# EAGLE design Busboard v4 (EAGLE 7.3.0)
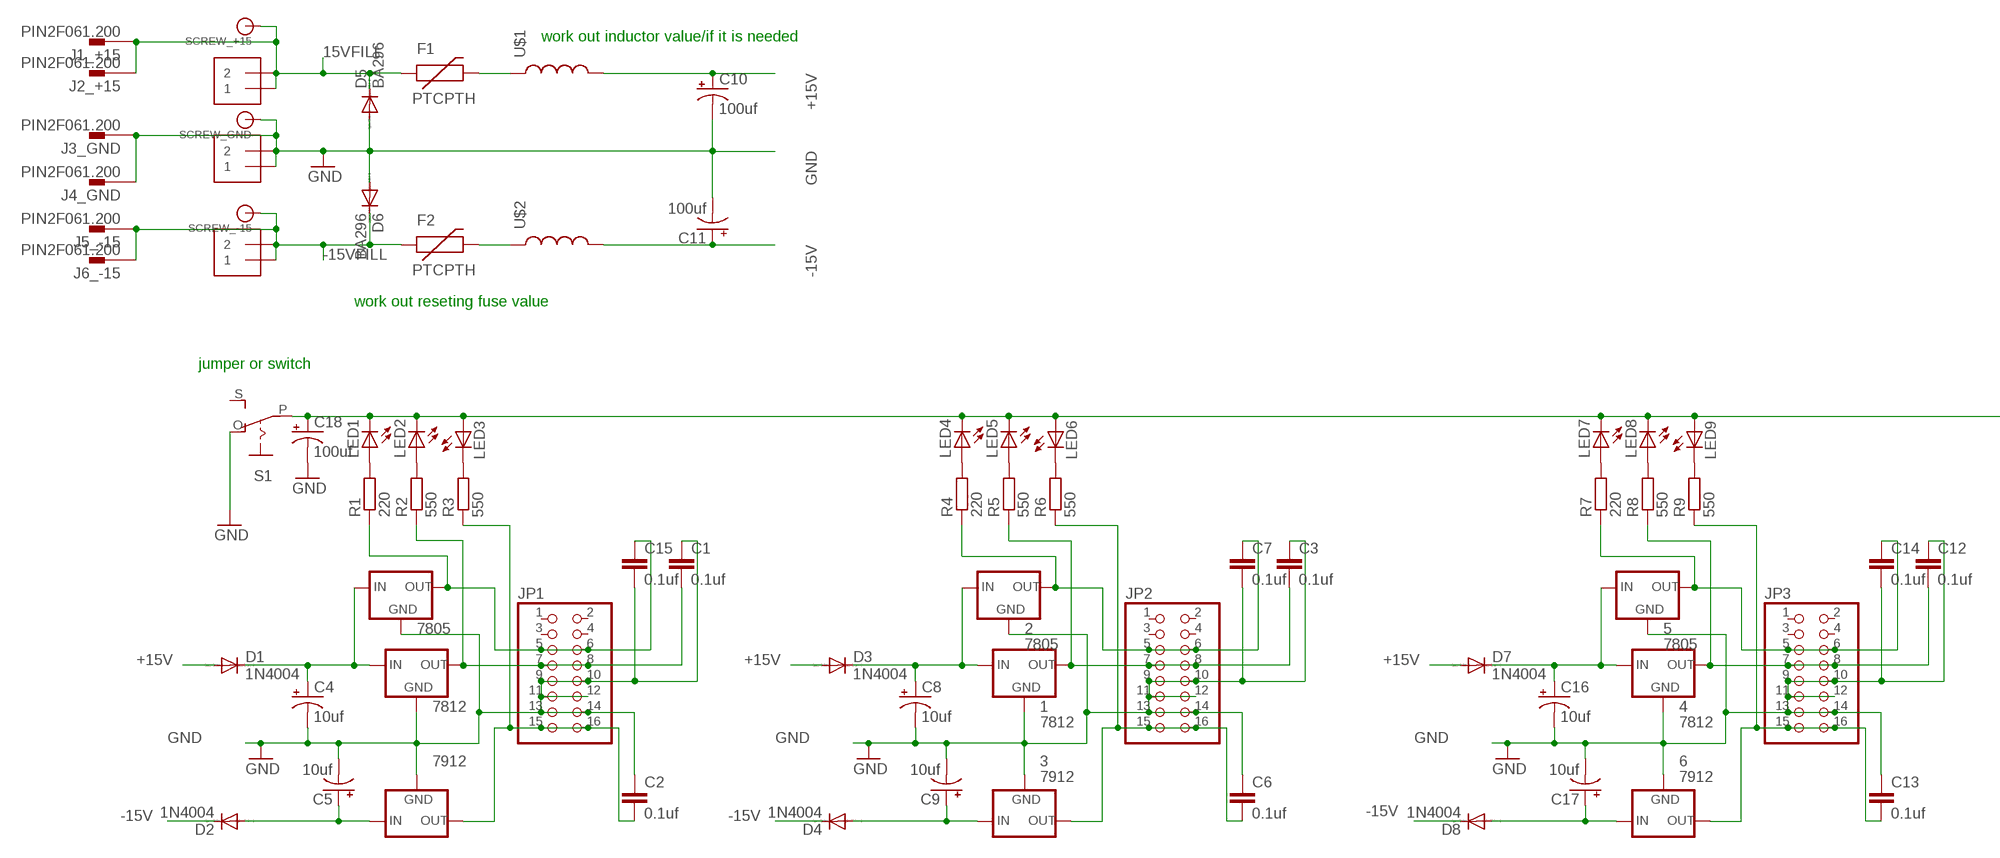
[diagram p0: schematic, sheet 1, part 1 of 2]
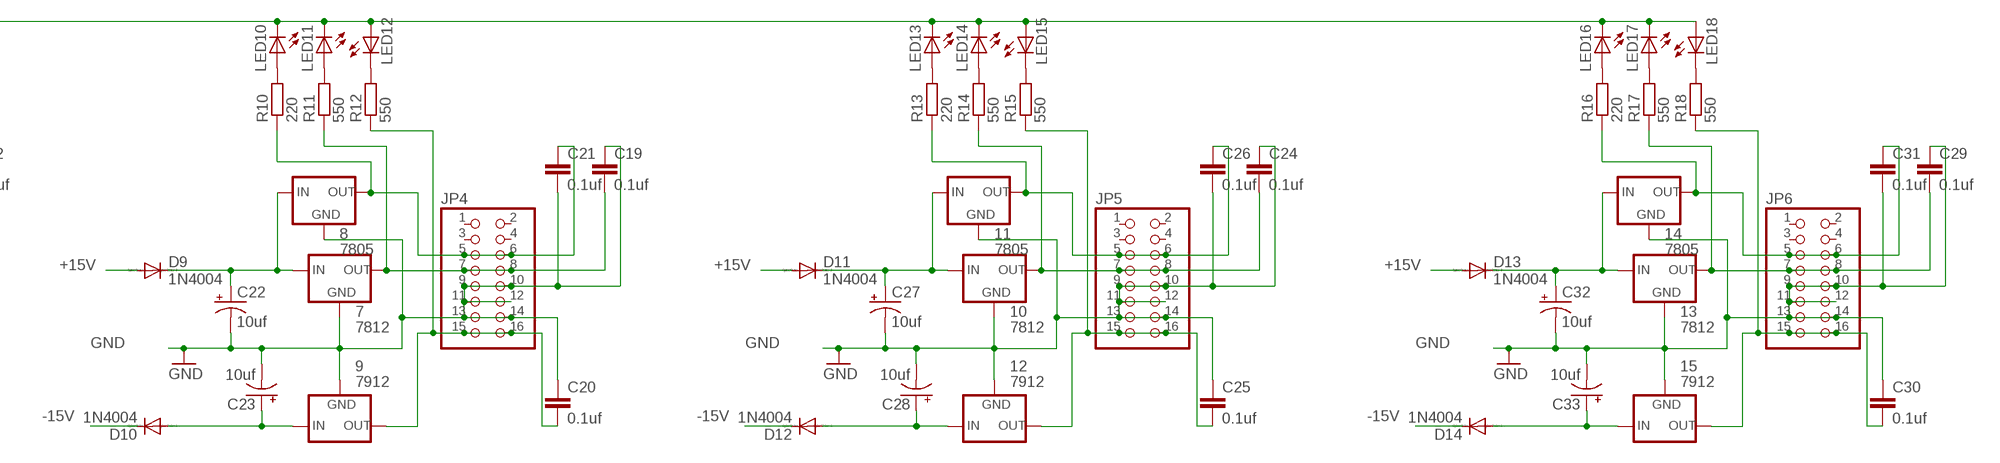
[diagram p1: schematic, sheet 1, part 2 of 2]

## Parts
1  7812  78MXXS  [78MXXS]
2  7805  78MXXS  [78MXXS]
3  7912  79XXS  [79XXS]
4  7812  78MXXS  [78MXXS]
5  7805  78MXXS  [78MXXS]
6  7912  79XXS  [79XXS]
7  7812  78MXXS  [78MXXS]
8  7805  78MXXS  [78MXXS]
9  7912  79XXS  [79XXS]
10  7812  78MXXS  [78MXXS]
11  7805  78MXXS  [78MXXS]
12  7912  79XXS  [79XXS]
13  7812  78MXXS  [78MXXS]
14  7805  78MXXS  [78MXXS]
15  7912  79XXS  [79XXS]
7805  78MXXS  [78MXXS]
7812  78MXXS  [78MXXS]
7912  79XXS  [79XXS]
+15V_DC_IN  1X2-3.5MM  [1X2-3.5MM]
-15V_DC_IN  1X2-3.5MM  [1X2-3.5MM]
C1  0.1uf  0.1UF-50V-20%(PTH)KIT-EZ  [CAP-PTH-SMALL-KIT]
C2  0.1uf  0.1UF-50V-20%(PTH)KIT-EZ  [CAP-PTH-SMALL-KIT]
C3  0.1uf  0.1UF-50V-20%(PTH)KIT-EZ  [CAP-PTH-SMALL-KIT]
C4  10uf  10UF-25V-20%(PTH)  [CPOL-RADIAL-10UF-25V]
C5  10uf  10UF-25V-20%(PTH)  [CPOL-RADIAL-10UF-25V]
C6  0.1uf  0.1UF-50V-20%(PTH)KIT-EZ  [CAP-PTH-SMALL-KIT]
C7  0.1uf  0.1UF-50V-20%(PTH)KIT-EZ  [CAP-PTH-SMALL-KIT]
C8  10uf  10UF-25V-20%(PTH)  [CPOL-RADIAL-10UF-25V]
C9  10uf  10UF-25V-20%(PTH)  [CPOL-RADIAL-10UF-25V]
C10  100uf  100UF-25V-20%(PTH)  [CPOL-RADIAL-100UF-25V]
C11  100uf  100UF-25V-20%(PTH)  [CPOL-RADIAL-100UF-25V]
C12  0.1uf  0.1UF-50V-20%(PTH)KIT-EZ  [CAP-PTH-SMALL-KIT]
C13  0.1uf  0.1UF-50V-20%(PTH)KIT-EZ  [CAP-PTH-SMALL-KIT]
C14  0.1uf  0.1UF-50V-20%(PTH)KIT-EZ  [CAP-PTH-SMALL-KIT]
C15  0.1uf  0.1UF-50V-20%(PTH)KIT-EZ  [CAP-PTH-SMALL-KIT]
C16  10uf  10UF-25V-20%(PTH)  [CPOL-RADIAL-10UF-25V]
C17  10uf  10UF-25V-20%(PTH)  [CPOL-RADIAL-10UF-25V]
C18  100uf  100UF-25V-20%(PTH)  [CPOL-RADIAL-100UF-25V]
C19  0.1uf  0.1UF-50V-20%(PTH)KIT-EZ  [CAP-PTH-SMALL-KIT]
C20  0.1uf  0.1UF-50V-20%(PTH)KIT-EZ  [CAP-PTH-SMALL-KIT]
C21  0.1uf  0.1UF-50V-20%(PTH)KIT-EZ  [CAP-PTH-SMALL-KIT]
C22  10uf  10UF-25V-20%(PTH)  [CPOL-RADIAL-10UF-25V]
C23  10uf  10UF-25V-20%(PTH)  [CPOL-RADIAL-10UF-25V]
C24  0.1uf  0.1UF-50V-20%(PTH)KIT-EZ  [CAP-PTH-SMALL-KIT]
C25  0.1uf  0.1UF-50V-20%(PTH)KIT-EZ  [CAP-PTH-SMALL-KIT]
C26  0.1uf  0.1UF-50V-20%(PTH)KIT-EZ  [CAP-PTH-SMALL-KIT]
C27  10uf  10UF-25V-20%(PTH)  [CPOL-RADIAL-10UF-25V]
C28  10uf  10UF-25V-20%(PTH)  [CPOL-RADIAL-10UF-25V]
C29  0.1uf  0.1UF-50V-20%(PTH)KIT-EZ  [CAP-PTH-SMALL-KIT]
C30  0.1uf  0.1UF-50V-20%(PTH)KIT-EZ  [CAP-PTH-SMALL-KIT]
C31  0.1uf  0.1UF-50V-20%(PTH)KIT-EZ  [CAP-PTH-SMALL-KIT]
C32  10uf  10UF-25V-20%(PTH)  [CPOL-RADIAL-10UF-25V]
C33  10uf  10UF-25V-20%(PTH)  [CPOL-RADIAL-10UF-25V]
D1  1N4004  [DO41-10]
D2  1N4004  [DO41-10]
D3  1N4004  [DO41-10]
D4  1N4004  [DO41-10]
D5  BA296  [P2-15]
D6  BA296  [P2-15]
D7  1N4004  [DO41-10]
D8  1N4004  [DO41-10]
D9  1N4004  [DO41-10]
D10  1N4004  [DO41-10]
D11  1N4004  [DO41-10]
D12  1N4004  [DO41-10]
D13  1N4004  [DO41-10]
D14  1N4004  [DO41-10]
F1  PTCPTH  [PTC]
F2  PTCPTH  [PTC]
GND_IN  1X2-3.5MM  [1X2-3.5MM]
J1_+15  PIN2F061.200  [F061.200]
J2_+15  PIN2F061.200  [F061.200]
J3_GND  PIN2F061.200  [F061.200]
J4_GND  PIN2F061.200  [F061.200]
J5_-15  PIN2F061.200  [F061.200]
J6_-15  PIN2F061.200  [F061.200]
JP1  PINHD-2X8  [2X08]
JP2  PINHD-2X8  [2X08]
JP3  PINHD-2X8  [2X08]
JP4  PINHD-2X8  [2X08]
JP5  PINHD-2X8  [2X08]
JP6  PINHD-2X8  [2X08]
LED1  LED3MM  [LED3MM]
LED2  LED3MM  [LED3MM]
LED3  LED3MM  [LED3MM]
LED4  LED3MM  [LED3MM]
LED5  LED3MM  [LED3MM]
LED6  LED3MM  [LED3MM]
LED7  LED3MM  [LED3MM]
LED8  LED3MM  [LED3MM]
LED9  LED3MM  [LED3MM]
LED10  LED3MM  [LED3MM]
LED11  LED3MM  [LED3MM]
LED12  LED3MM  [LED3MM]
LED13  LED3MM  [LED3MM]
LED14  LED3MM  [LED3MM]
LED15  LED3MM  [LED3MM]
LED16  LED3MM  [LED3MM]
LED17  LED3MM  [LED3MM]
LED18  LED3MM  [LED3MM]
R1  220  R-EU_0207/5V  [0207/5V]
R2  550  R-EU_0207/5V  [0207/5V]
R3  550  R-EU_0207/5V  [0207/5V]
R4  220  R-EU_0207/5V  [0207/5V]
R5  550  R-EU_0207/5V  [0207/5V]
R6  550  R-EU_0207/5V  [0207/5V]
R7  220  R-EU_0207/5V  [0207/5V]
R8  550  R-EU_0207/5V  [0207/5V]
R9  550  R-EU_0207/5V  [0207/5V]
R10  220  R-EU_0207/5V  [0207/5V]
R11  550  R-EU_0207/5V  [0207/5V]
R12  550  R-EU_0207/5V  [0207/5V]
R13  220  R-EU_0207/5V  [0207/5V]
R14  550  R-EU_0207/5V  [0207/5V]
R15  550  R-EU_0207/5V  [0207/5V]
R16  220  R-EU_0207/5V  [0207/5V]
R17  550  R-EU_0207/5V  [0207/5V]
R18  550  R-EU_0207/5V  [0207/5V]
S1  EG1218S  [EG1218]
SCREW_+15  BANANA_CONN  [BANANA_CONN]
SCREW_-15  BANANA_CONN  [BANANA_CONN]
SCREW_GND  BANANA_CONN  [BANANA_CONN]
U$1  INDUCTORRLB0912  [RLB0912]
U$2  INDUCTORRLB0912  [RLB0912]

## Nets
15VFILL: +15V_DC_IN.1 +15V_DC_IN.2 D5.C F1.P$1 J1_+15.1A J1_+15.1B J2_+15.1A J2_+15.1B SCREW_+15.P$1
+15V: C10.1(+) D1.A D3.A D7.A D9.A D11.A D13.A U$1.2
-15V: C11.1(+) D2.C D4.C D8.C D10.C D12.C D14.C U$2.2
-15VFILL: -15V_DC_IN.1 -15V_DC_IN.2 D6.C F2.P$1 J5_-15.1A J5_-15.1B J6_-15.1A J6_-15.1B SCREW_-15.P$1
GND: 1.GND 2.GND 3.GND 4.GND 5.GND 6.GND 7.GND 8.GND 9.GND 10.GND 11.GND 12.GND 13.GND 14.GND 15.GND 7805.GND 7812.GND 7912.GND C1.1 C2.1 C3.1 C4.2(-) C5.2(-) C6.1 C7.2 C8.2(-) C9.2(-) C10.2(-) C11.2(-) C12.1 C13.1 C14.2 C15.2 C16.2(-) C17.2(-) C18.2(-) C19.1 C20.1 C21.2 C22.2(-) C23.2(-) C24.1 C25.1 C26.2 C27.2(-) C28.2(-) C29.1 C30.1 C31.2 C32.2(-) C33.2(-) D5.A D6.A GND_IN.1 GND_IN.2 J3_GND.1A J3_GND.1B J4_GND.1A J4_GND.1B JP1.9 JP1.10 JP1.11 JP1.12 JP1.13 JP1.14 JP2.9 JP2.10 JP2.11 JP2.12 JP2.13 JP2.14 JP3.9 JP3.10 JP3.11 JP3.12 JP3.13 JP3.14 JP4.9 JP4.10 JP4.11 JP4.12 JP4.13 JP4.14 JP5.9 JP5.10 JP5.11 JP5.12 JP5.13 JP5.14 JP6.9 JP6.10 JP6.11 JP6.12 JP6.13 JP6.14 S1.O SCREW_GND.P$1
N$1: 7912.IN C5.1(+) D2.A
N$2: 7912.OUT C2.2 JP1.15 JP1.16 R3.1
N$3: 6.OUT C13.2 JP3.15 JP3.16 R9.1
N$4: 7805.IN 7812.IN C4.1(+) D1.C
N$5: 7812.OUT C1.2 JP1.7 JP1.8 R2.1
N$6: 3.OUT C6.2 JP2.15 JP2.16 R6.1
N$7: 6.IN C17.1(+) D8.A
N$8: 3.IN C9.1(+) D4.A
N$9: 1.IN 2.IN C8.1(+) D3.C
N$10: C18.1(+) LED1.K(C) LED2.K(C) LED3.A LED4.K(C) LED5.K(C) LED6.A LED7.K(C) LED8.K(C) LED9.A LED10.K(C) LED11.K(C) LED12.A LED13.K(C) LED14.K(C) LED15.A LED16.K(C) LED17.K(C) LED18.A S1.P
N$11: F2.P$2 U$2.1
N$12: LED1.A R1.2
N$13: F1.P$2 U$1.1
N$14: LED2.A R2.2
N$17: LED3.K(C) R3.2
N$18: 1.OUT C3.2 JP2.7 JP2.8 R5.1
N$19: 4.IN 5.IN C16.1(+) D7.C
N$20: 2.OUT C7.1 JP2.5 JP2.6 R4.1
N$21: 7805.OUT C15.1 JP1.5 JP1.6 R1.1
N$23: LED4.A R4.2
N$24: LED5.A R5.2
N$25: LED6.K(C) R6.2
N$26: 4.OUT C12.2 JP3.7 JP3.8 R8.1
N$27: 5.OUT C14.1 JP3.5 JP3.6 R7.1
N$28: LED7.A R7.2
N$29: LED8.A R8.2
N$30: LED9.K(C) R9.2
N$47: 9.OUT C20.2 JP4.15 JP4.16 R12.1
N$48: 9.IN C23.1(+) D10.A
N$49: 7.IN 8.IN C22.1(+) D9.C
N$50: 7.OUT C19.2 JP4.7 JP4.8 R11.1
N$51: 8.OUT C21.1 JP4.5 JP4.6 R10.1
N$52: LED10.A R10.2
N$53: LED11.A R11.2
N$54: LED12.K(C) R12.2
N$55: 15.OUT C30.2 JP6.15 JP6.16 R18.1
N$56: 12.OUT C25.2 JP5.15 JP5.16 R15.1
N$57: 12.IN C28.1(+) D12.A
N$58: 10.IN 11.IN C27.1(+) D11.C
N$59: 10.OUT C24.2 JP5.7 JP5.8 R14.1
N$60: 11.OUT C26.1 JP5.5 JP5.6 R13.1
N$61: LED13.A R13.2
N$62: LED14.A R14.2
N$63: LED15.K(C) R15.2
N$64: 15.IN C33.1(+) D14.A
N$65: 13.IN 14.IN C32.1(+) D13.C
N$66: 13.OUT C29.2 JP6.7 JP6.8 R17.1
N$67: 14.OUT C31.1 JP6.5 JP6.6 R16.1
N$68: LED16.A R16.2
N$69: LED17.A R17.2
N$70: LED18.K(C) R18.2
Unconnected: JP1.1 JP1.2 JP1.3 JP1.4 JP2.1 JP2.2 JP2.3 JP2.4 JP3.1 JP3.2 JP3.3 JP3.4 JP4.1 JP4.2 JP4.3 JP4.4 JP5.1 JP5.2 JP5.3 JP5.4 JP6.1 JP6.2 JP6.3 JP6.4 S1.S

## Notes on the sheet
- work out inductor value/if it is needed
- work out reseting fuse value
- jumper or switch

## Library data of the parts
1 2 4 5 7 8 10 11 13 14 7805 7812 = v-reg:78MXXS: VOLTAGE REGULATOR
3 6 9 12 15 7912 = v-reg:79XXS: VOLTAGE REGULATOR
+15V_DC_IN -15V_DC_IN GND_IN = adafruit:1X2: 3.5mm Terminal block http://www.ladyada.net/library/pcb/eaglelibrary.html
C1-C3 C6 C7 C12-C15 C19-C21 C24-C26 C29-C31 = SparkFun-Capacitors:0.1UF-50V-20%(PTH): CAP-08370; PROD_ID: CAP-08370
C4 C5 C8 C9 C16 C17 C22 C23 C27 C28 C32 C33 = SparkFun-Capacitors:10UF-25V-20%(PTH): CAP-08440; PROD_ID: CAP-08440
C10 C11 C18 = SparkFun-Capacitors:100UF-25V-20%(PTH): CAP-08439; PROD_ID: CAP-08439
D1-D4 D7-D14 = diode:1N4004: DIODE general purpose rectifier, 1 A
D5 D6 = diode:BA296: DIODE
F1 F2 = SparkFun-PowerIC:PTC: Resettable Fuse PTC Resettable Fuse. Spark Fun Electronics SKU : COM-08357
J1_+15 J2_+15 J3_GND J4_GND J5_-15 J6_-15 = con-faston:PIN2: Flachstecker Typ Tyco/Electronics/AMP TAB, FASTON Printed Circuit Board Tabs Source: http://www.buerklin.com, http://catalog.tycoelectronics.com; OC_FARNELL: unknown; OC_NEWARK: unknown
JP1-JP6 = pinhead:PINHD-2X8: PIN HEADER
LED1-LED18 = led:LED: LED OSRAM: - CHIPLED LG R971, LG N971, LY N971, LG Q971, LY Q971, LO R971, LY R971 LH N974, LH R974 LS Q976, LO Q976, LY Q976 LO Q996 - Hyper CHIPLED LW Q18S LB Q993, LB Q99A, LB R99A - SideLED LS A670, LO A670, LY A670, LG A670, LP A670 LB A673, LV A673, LT A673, LW A673 LH A674 LY A675 LS A676, LA A676, LO A676, LY A676, LW A676 LS A679, LY A679, LG A679 - Hyper Micro SIDELED® LS Y876, LA Y876, LO Y876, LY Y876 LT Y87S - SmartLED LW L88C, LW L88S LB L89C, LB L89S, LG L890 LS L89K, LO L89K, LY L89K LS L896, LA L896, LO L896, LY L896 - TOPLED LS T670, LO T670, LY T670, LG T670, LP T670 LSG T670, LSP T670, LSY T670, LOP T670, LYG T670 LG T671, LOG T671, LSG T671 LB T673, LV T673, LT T673, LW T673 LH T674 LS T676, LA T676, LO T676, LY T676, LB T676, LH T676, LSB T676, LW T676 LB T67C, LV T67C, LT T67C, LS T67K, LO T67K, LY T67K, LW E67C LS E67B, LA E67B, LO E67B, LY E67B, LB E67C, LV E67C, LT E67C LW T67C LS T679, LY T679, LG T679 LS T770, LO T770, LY T770, LG T770, LP T770 LB T773, LV T773, LT T773, LW T773 LH T774 LS E675, LA E675, LY E675, LS T675 LS T776, LA T776, LO T776, LY T776, LB T776 LHGB T686 LT T68C, LB T68C - Hyper Mini TOPLED® LB M676 - Mini TOPLED Santana® LG M470 LS M47K, LO M47K, LY M47K Source: http://www.osram.convergy.de LUXEON: - LUMILED® LXK2-PW12-R00, LXK2-PW12-S00, LXK2-PW14-U00, LXK2-PW14-V00 LXK2-PM12-R00, LXK2-PM12-S00, LXK2-PM14-U00 LXK2-PE12-Q00, LXK2-PE12-R00, LXK2-PE12-S00, LXK2-PE14-T00, LXK2-PE14-U00 LXK2-PB12-K00, LXK2-PB12-L00, LXK2-PB12-M00, LXK2-PB14-N00, LXK2-PB14-P00, LXK2-PB14-Q00 LXK2-PR12-L00, LXK2-PR12-M00, LXK2-PR14-Q00, LXK2-PR14-R00 LXK2-PD12-Q00, LXK2-PD12-R00, LXK2-PD12-S00 LXK2-PH12-R00, LXK2-PH12-S00 LXK2-PL12-P00, LXK2-PL12-Q00, LXK2-PL12-R00 Source: www.luxeon.com KINGBRIGHT: KA-3528ASYC Source: www.kingbright.com
R1-R18 = resistor:R-EU_: RESISTOR, European symbol
S1 = adafruit:EG1218: SLIDING SWITCH 0.1" spacing through hole, vertical SPDT slide switch http://www.ladyada.net/library/pcb/eaglelibrary.html
SCREW_+15 SCREW_-15 SCREW_GND = SparkFun-Connectors:BANANA_CONN: Through-hole banana jack
U$1 U$2 = SparkFun-Passives:INDUCTOR: Inductors Basic Inductor/Choke - 0603 and 1206. Footprints are not proven and vary greatly between part numbers. SRN6045- 33uH, 20% 1.4A SDR0403-560KL - 56uH, 10%, 500mA RMS/740mA peak

## Board
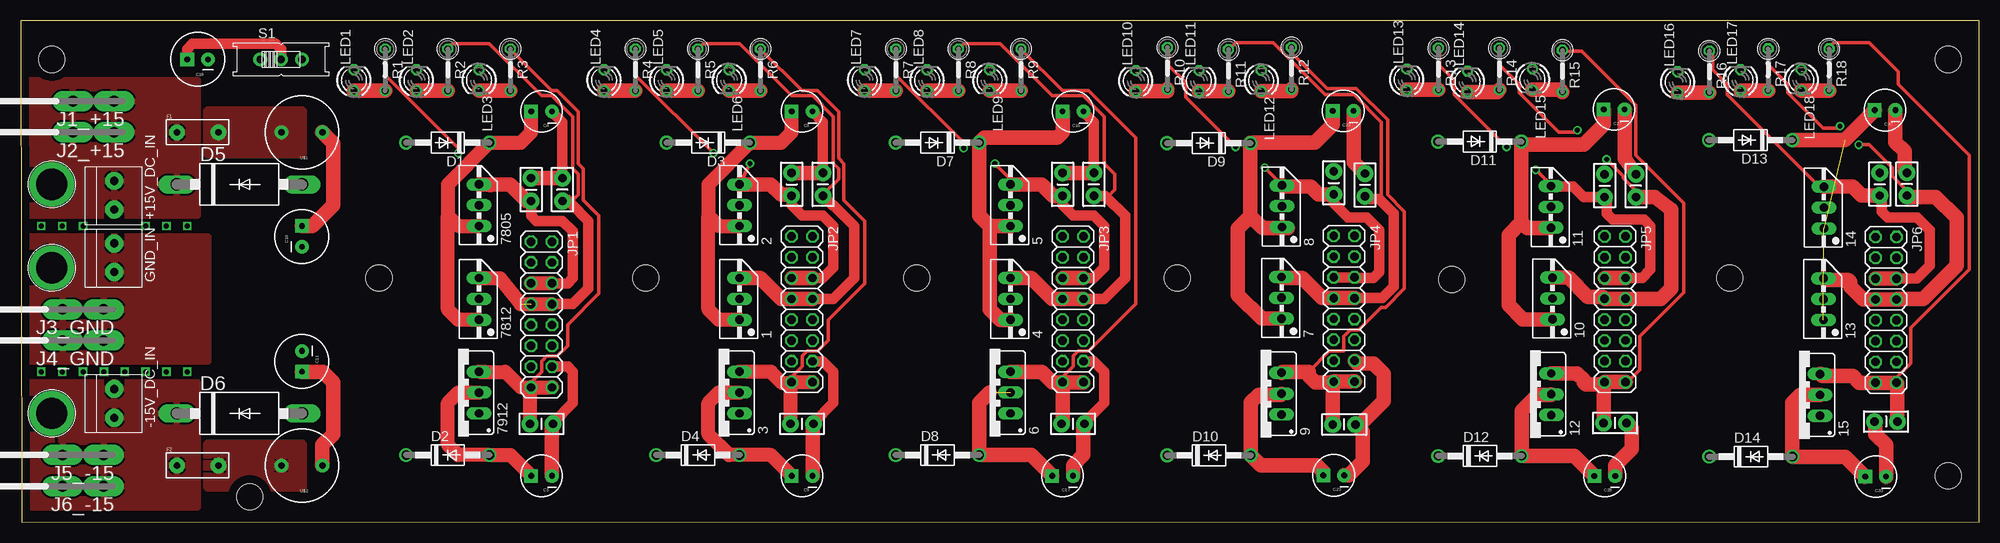
[diagram p2: board, top side]
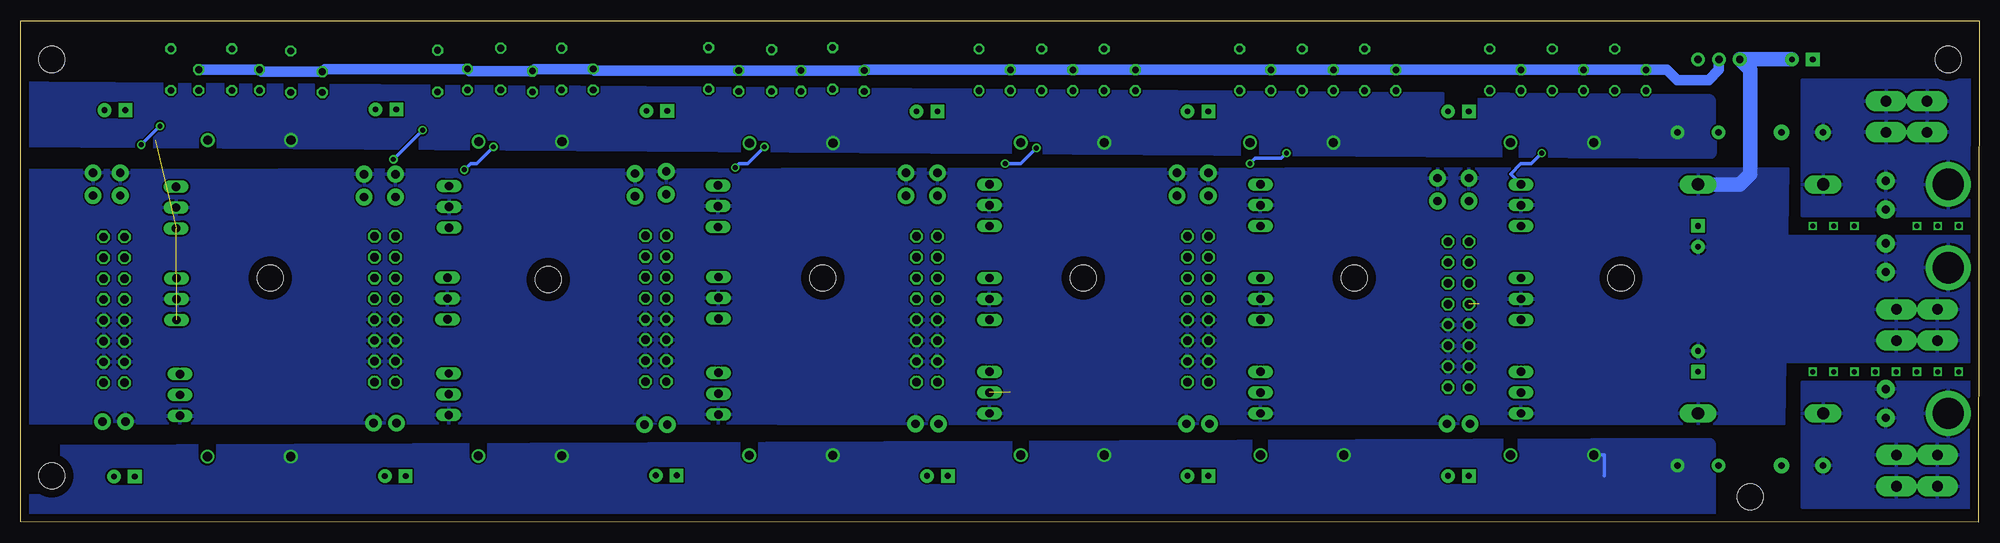
[diagram p3: board, bottom side, seen from below]

Size 238.74 x 61.21 mm. Coordinates in mm from the lower left corner, seen from the top.
Outline: 0.15,0 238.74,0.08 238.74,61.21 0,61.21 0.15,0
Copper layers (1*16): Top 0.035mm / dielectric 1.5mm / Bottom 0.035mm
Design rules "default": minimum track width 10mil, minimum drill 24mil, track to track 8mil, track to pad 8mil, pad to pad 8mil, via to via 8mil, smd to smd 8mil, copper to edge 40mil, drill to drill 8mil, minimum pad ring 10mil, minimum via ring 8mil, stop-mask expansion 4mil, vias tented up to drill 0mil, thermal gap 10mil
Holes 3.2 mm at 109.22,29.79 140.97,29.79 27.94,3.12 3.81,56.46 234.95,56.46 234.95,5.66 174.45,29.62 76.2,29.79 208.28,29.79 43.69,29.79

### Footprints (pad centres in the part's own frame; a part is rotated, then mirrored left to right if it is on the bottom)
78MXXS = drill 1.016 long: GND 0,-2.54; IN -2.54,-2.54; OUT 2.54,-2.54
79XXS = drill 1.016 long: GND -2.54,-2.54; IN 0,-2.54; OUT 2.54,-2.54
1X2-3.5MM = drill 1 pad 2.184: 1 1.8,0; 2 -1.7,0
CAP-PTH-SMALL-KIT = drill 1.016 pad 2.032: 1 -1.397,0; 2 1.397,0
CPOL-RADIAL-10UF-25V = drill 0.7 pad 1.651 square: 1 1.27,0 | drill 0.7 pad 1.651: 2 -1.27,0
CPOL-RADIAL-100UF-25V = drill 0.7 pad 1.651 square: 1 1.27,0 | drill 0.7 pad 1.651: 2 -1.27,0
DO41-10 = drill 1.118: A 5.08,0; C -5.08,0
P2-15 = drill 1.499 long: A 7.62,0; C -7.62,0
PTC = drill 0.8 pad 1.88: P$1 -2.54,0; P$2 2.54,0
F061.200 = drill 1.3 pad 2.5 long: 1A -2.5,0; 1B 2.5,0
2X08 = drill 1.016 octagon: 1 -8.89,-1.27; 2 -8.89,1.27; 3 -6.35,-1.27; 4 -6.35,1.27; 5 -3.81,-1.27; 6 -3.81,1.27; 7 -1.27,-1.27; 8 -1.27,1.27; 9 1.27,-1.27; 10 1.27,1.27; 11 3.81,-1.27; 12 3.81,1.27; 13 6.35,-1.27; 14 6.35,1.27; 15 8.89,-1.27; 16 8.89,1.27
LED3MM = drill 0.813 octagon: A -1.27,0; K 1.27,0
0207/5V = drill 0.813 octagon: 1 -2.54,0; 2 2.54,0
EG1218 = drill 0.9 pad 1.676: O -2.54,0; P 0,0; S 2.54,0
BANANA_CONN = drill 3.81 pad 5.461: P$1 0,0
RLB0912 = drill 0.813 pad 1.651: 1 2.502,0; 2 -2.502,0

### Placement (x,y rotation side)
1  85.09,27.25 90 top
2  85.09,38.68 90 top
3  85.09,15.82 90 top
4  118.11,27.25 90 top
5  118.11,38.68 90 top
6  118.11,15.82 90 top
7  151.15,27.38 90 top
8  151.2,38.56 90 top
9  151.15,15.7 90 top
10  184.17,27.3 90 top
11  183.97,38.48 90 top
12  184.02,15.62 90 top
13  217.19,27.23 90 top
14  217.24,38.4 90 top
15  216.78,15.54 90 top
7805  53.34,38.68 90 top
7812  53.34,27.25 90 top
7912  53.34,15.82 90 top
+15V_DC_IN  11.43,39.95 270 top
-15V_DC_IN  11.43,14.55 270 top
C1  66.04,40.59 270 top
C2  63.5,12.01 180 top
C3  97.79,41.22 270 top
C4  63.5,50.11 180 top
C5  63.5,5.66 180 top
C6  95.25,12.01 180 top
C7  93.98,41.22 90 top
C8  95.25,50.11 180 top
C9  95.25,5.66 180 top
C10  34.29,34.87 90 top
C11  34.29,19.63 270 top
C12  130.81,41.22 270 top
C13  128.27,12.01 180 top
C14  127,41.22 90 top
C15  62.23,40.59 90 top
C16  128.27,50.11 180 top
C17  127,5.66 180 top
C18  21.59,56.46 180 top
C19  163.85,41.15 270 top
C20  161.31,11.94 180 top
C21  160.04,41.4 90 top
C22  161.19,50.18 180 top
C23  160.05,5.73 180 top
C24  196.87,41.07 270 top
C25  194.33,12.12 180 top
C26  193.06,41.07 90 top
C27  194.21,50.36 180 top
C28  193.07,5.65 180 top
C29  229.89,41.25 270 top
C30  227.35,12.29 0 top
C31  226.59,41.25 90 top
C32  227.23,50.28 180 top
C33  226.09,5.58 180 top
D1  52.07,46.3 180 top
D2  52.07,8.2 0 top
D3  83.82,46.3 180 top
D4  82.55,8.2 0 top
D5  26.67,41.22 0 top
D6  26.67,13.28 0 top
D7  111.76,46.3 180 top
D8  111.76,8.2 0 top
D9  144.81,46.27 180 top
D10  144.84,8.17 0 top
D11  177.83,46.45 180 top
D12  177.86,8.09 0 top
D13  210.85,46.63 180 top
D14  210.88,8.02 0 top
F1  21.59,47.57 0 top
F2  21.59,6.93 0 top
GND_IN  11.43,32.33 270 top
J1_+15  8.89,51.38 180 top
J2_+15  8.89,47.57 180 top
J3_GND  7.62,25.98 180 top
J4_GND  7.62,22.17 180 top
J5_-15  7.62,8.2 180 top
J6_-15  7.62,4.39 180 top
JP1  63.5,25.35 270 top
JP2  95.25,25.98 270 top
JP3  128.27,25.98 270 top
JP4  161.31,26.07 270 top
JP5  194.33,25.99 270 top
JP6  227.35,25.92 270 top
LED1  40.64,53.92 90 top
LED2  48.26,53.92 90 top
LED3  55.88,53.92 270 top
LED4  71.12,53.92 90 top
LED5  78.74,53.92 90 top
LED6  86.36,53.92 270 top
LED7  102.87,53.92 90 top
LED8  110.49,53.92 90 top
LED9  118.11,53.92 270 top
LED10  135.92,53.85 90 top
LED11  143.62,53.85 90 top
LED12  151.2,53.85 270 top
LED13  168.94,54.03 90 top
LED14  176.35,53.77 90 top
LED15  184.26,54.03 270 top
LED16  201.96,53.69 90 top
LED17  209.62,53.95 90 top
LED18  217.02,53.95 270 top
R1  44.45,55.19 270 top
R2  52.07,55.19 270 top
R3  59.69,55.19 270 top
R4  74.93,55.19 270 top
R5  82.55,55.19 270 top
R6  90.17,55.19 270 top
R7  106.68,55.19 270 top
R8  114.3,55.19 270 top
R9  121.92,55.19 270 top
R10  139.77,55.37 270 top
R11  147.2,55.12 270 top
R12  154.88,55.37 270 top
R13  172.79,55.3 270 top
R14  180.22,55.3 270 top
R15  187.9,55.04 270 top
R16  205.81,54.96 270 top
R17  212.99,55.22 270 top
R18  220.42,55.22 270 top
S1  31.75,56.46 0 top
SCREW_+15  3.81,41.22 0 top
SCREW_-15  3.81,13.28 0 top
SCREW_GND  3.81,31.06 0 top
U$1  34.29,47.57 180 top
U$2  34.29,6.93 180 top

### Tracks (layer width: path | path; a pad name or v marks a point on that pad's centre or on a via)
15VFILL
  pour Top: -3.81,37.41 21.59,37.41 21.59,53.92 -3.81,53.92
  pour Bottom: -5.08,37.41 21.59,37.41 21.59,53.92 -5.08,53.92
+15V
  Top 1.778: C10.1 35.56,36.14 38.1,38.68 38.1,46.27 U$1.2
  pour Bottom: 32.87,45.14 300.48,47.07 267.72,53.16 33.02,51.38
-15V
  Top 1.778: U$2.2 36.79,9.44 38.1,10.74 38.1,17.09 36.83,18.36 C11.1
  Bottom 0.406: D2.C 45.72,8.2 45.72,5.66
  pour Bottom: 262.64,-0.69 262.89,8.46 33.02,9.47 33.02,-0.69
-15VFILL
  pour Top: -2.54,17.09 21.59,17.09 21.59,1.85 -2.54,1.85
  pour Bottom: -6.35,17.09 21.59,17.09 21.59,1.85 -6.35,1.85
GND
  Top 1.27: C13.1 129.67,12.14 132.08,14.55 132.08,18.36 130.81,19.63 JP3.14 | C6.1 96.65,12.14 99.06,14.55 99.06,18.36 97.79,19.63 JP2.14 | C2.1 64.9,12.14 67.31,14.55 67.31,18.36 66.67,19 JP1.14 | C12.1 130.81,48.84 C16.2 | C3.1 97.79,48.84 C8.2 | C1.1 66.04,48.84 C4.2
  Top 1.778: C5.2 64.77,11.89 C2.1 | C9.2 96.52,11.89 C6.1 | C12.1 C14.2 | C3.1 C7.2 | C15.2 C1.1 | C17.2 128.27,6.93 129.54,8.2 129.54,11.89 C13.1 | C23.2 161.86,5.73 163.58,7.44 163.58,11.07 C20.1 163.25,11.94 166.12,14.81 166.12,18.11 164.85,19.38 162.92,19.38 JP4.14 | C22.2 162.46,43.93 C19.1 | C28.2 194.34,6.96 196.34,8.97 196.34,11.5 C25.1 | C27.2 195.48,44.36 C24.1 | C33.2 227.36,9.45 226.06,10.74 226.06,12.19 C30.1 | C32.2 228.5,46.4 229.62,45.29 229.62,42.92 C29.1
  Bottom 1.778: D5.A 29.21,41.22 27.94,42.49 27.94,55.19 S1.O C18.2
  pour Bottom: -1.27,19.63 24.13,19.63 24.13,34.87 -3.81,34.87
  pour Top: -5.08,34.87 22.86,34.87 22.86,19.63 -2.54,19.63
  pour Bottom: 23.88,12.01 269.24,12.14 268.73,42.88 23.37,43.13
N$1
  Top 1.676: C5.1 59.69,8.2 D2.A 53.34,8.2 52.07,9.47 52.07,14.55 53.34,15.82 7912.IN
N$2
  Top 0.406: R3.1 64.77,52.65 65.41,52.65 67.94,50.11 67.94,43.76 68.58,43.13 68.58,39.32 70.48,37.41 70.48,27.89 66.67,24.08 66.67,21.54 65.41,20.27 64.14,20.27 63.5,19.63 63.5,18.36 62.23,17.09 JP1.15
  Top 1.676: 7912.OUT 59.05,18.36 60.96,16.46 JP1.15 | JP1.15 JP1.16 | C2.2 62.1,16.33 JP1.15
N$3
  Top 0.406: R9.1 127,52.65 130.18,52.65 135.89,46.94 135.89,26.62 130.18,20.9 128.91,20.9 128.27,20.27 128.27,19 127,17.73 JP3.15
  Top 1.778: JP3.15 JP3.16 | JP3.15 125.73,17.09 124.46,18.36 6.OUT | JP3.15 127,12.14 C13.2
N$4
  Top 1.676: C4.1 62.23,47.57 60.96,46.3 D1.C 52.07,41.22 52.07,37.41 | 52.07,37.41 53.34,36.14 7805.IN | 7812.IN 53.34,24.71 52.07,25.98 52.07,37.41
N$5  (1 unrouted)
  Top 0.406: R2.1 52.7,58.37 57.15,58.37 63.5,52.02 64.77,52.02 67.31,49.48 67.31,43.13 67.94,42.49 67.94,39.95 66.99,39
  Top 1.27: JP1.8 67.31,26.62 69.22,28.52 69.22,36.78 66.99,39 66.67,39.32 66.17,39.32 C1.2
  Top 1.676: 7812.OUT 58.42,29.79 60.96,26.62 JP1.8
N$6
  Top 0.406: R6.1 95.25,52.65 97.16,52.65 99.69,50.11 99.69,44.4 100.33,43.76 100.33,39.32 102.87,36.78 102.87,29.16 98.42,24.71 98.42,22.17 97.16,20.9 95.89,20.9 95.25,20.27 95.25,19 93.98,17.73 JP2.15
  Top 1.676: C6.2 93.85,16.97 | 93.85,16.97 JP2.15 JP2.16 | 93.85,16.97 92.84,16.97 91.44,18.36 3.OUT
N$7  (1 unrouted)
  Top 1.778: C17.1 123.19,8.2 D8.A 116.84,14.55 118.11,15.82
N$8
  Top 1.676: C9.1 91.44,8.2 D4.A 86.36,8.2 83.82,10.74 83.82,14.55 85.09,15.82 3.IN
N$9
  Top 1.676: 83.82,37.41 83.82,41.22 D3.C 92.71,46.3 93.98,47.57 C8.1 | 83.82,37.41 85.09,36.14 2.IN | 1.IN 85.09,24.71 83.82,25.98 83.82,37.41
N$10
  Top 1.27: C18.1 20.32,57.73 20.95,58.37 31.11,58.37 31.75,57.73 S1.P
  Bottom 1.27: S1.P 31.75,55.19 33.02,53.92 36.83,53.92 38.1,55.19 LED1.K LED2.K LED3.A LED4.K LED5.K LED6.A LED7.K LED8.K LED9.A 135.85,55.19 LED10.K LED11.K LED12.A 168.76,55.12 LED13.K 176.09,55.3 LED14.K 184,55.04 LED15.A 201.63,55.3 LED16.K 209.37,54.97 LED17.K LED18.A
N$11
  pour Top: 22.86,4.39 22.86,9.47 34.29,9.47 34.29,4.39
N$12
  Top 1.778: R1.2 LED1.A
N$13
  pour Top (no thermals): 22.86,50.11 34.29,50.11 34.29,45.03 22.86,45.03
N$14
  Top 1.778: R2.2 LED2.A
N$15  (via drill 0.6)
  other vias: 2.54,18.36
N$16  (via drill 0.6)
  other vias: 5.08,18.36
N$17
  Top 1.778: R3.2 LED3.K
N$18
  Top 0.406: R5.1 83.19,58.37 87.63,58.37 93.98,52.02 96.52,52.02 99.06,49.48 99.06,43.76 99.69,43.13 99.69,41.86 97.79,39.95 C3.2
  Top 1.27: JP2.8 99.06,27.25 101.6,29.79 101.6,36.14 99.06,38.68 98.93,38.68 C3.2
  Top 1.778: JP2.8 JP2.7 92.71,27.25 90.17,29.79 1.OUT
N$19
  Top 1.778: 4.IN 119.38,24.71 118.11,25.98 118.11,36.14 | 118.11,36.14 116.84,37.41 D7.C 117.47,46.94 126.36,46.94 127,47.57 C16.1 | 5.IN 118.11,36.14
N$20  (via drill 0.6)
  Top 0.406: R4.1 74.93,54.56 v84.45,45.03 | 2.OUT v88.9,43.76
  Top 1.27: C7.1 93.98,38.68 95.25,37.41 97.79,37.41 99.06,36.14 99.06,31.06 97.79,29.79 JP2.6
  Top 1.778: JP2.5 JP2.6 | 2.OUT 91.44,41.22 92.71,39.95 93.85,39.95 C7.1
  Bottom 0.406: v84.45,45.03 85.09,44.4 88.27,44.4 v88.9,43.76
N$21  (via drill 0.6)
  Top 0.406: R1.1 44.45,54.56 53.34,45.67 v53.34,45.03
  Top 1.27: C15.1 62.23,37.41 62.87,36.78 66.04,36.78 67.31,35.51 67.31,29.79 66.67,29.16 JP1.6
  Top 1.676: JP1.6 JP1.5 | 57.28,41.1 7805.OUT
  Top 1.778: C15.1 61.72,39.19 59.69,41.22 7805.OUT
  Bottom 0.406: v53.34,45.03 54.61,43.76 55.88,43.76 57.15,42.49 7805.OUT
N$22  (via drill 0.6)
  other vias: 7.62,18.36
N$23
  Top 1.778: LED4.A R4.2
N$24
  Top 1.778: LED5.A R5.2
N$25
  Top 1.778: LED6.K R6.2
N$26
  Top 0.406: R8.1 114.94,58.37 119.38,58.37 125.73,52.02 129.54,52.02 132.08,49.48 132.08,43.76 133.35,42.49 133.35,40.59 132.4,39.64
  Top 1.27: C12.2 132.21,39.83 132.4,39.64 134.62,37.41 134.62,29.79 132.08,27.25 JP3.8
  Top 1.778: JP3.8 JP3.7 125.73,27.25 123.19,29.79 4.OUT
N$27  (via drill 0.6)
  Top 0.406: R7.1 106.68,54.56 114.94,46.3 v114.94,45.67 | v118.75,43.76 121.28,41.22 5.OUT
  Top 1.27: C14.1 127,38.68 128.27,37.41 130.81,37.41 132.08,36.14 132.08,31.06 130.81,29.79 JP3.6
  Top 1.778: JP3.5 JP3.6 | C14.1 125.86,39.83 124.46,41.22 5.OUT
  Bottom 0.406: v114.94,45.67 116.84,43.76 v118.75,43.76
N$28
  Top 1.778: R7.2 LED7.A
N$29
  Top 1.778: R8.2 LED8.A
N$30
  Top 1.778: R9.2 LED9.K
N$31  (via drill 0.6)
  other vias: 10.16,18.36
N$32  (via drill 0.6)
  other vias: 12.7,18.36
N$33  (via drill 0.6)
  other vias: 15.24,18.36
N$34  (via drill 0.6)
  other vias: 17.78,18.36
N$35  (via drill 0.6)
  other vias: 20.32,18.36
N$36  (via drill 0.6)
  other vias: 2.54,36.14
N$37  (via drill 0.6)
  other vias: 5.08,36.14
N$38  (via drill 0.6)
  other vias: 7.62,36.14
N$40  (via drill 0.6)
  other vias: 15.24,36.14
N$41  (via drill 0.6)
  other vias: 17.78,36.14
N$42  (via drill 0.6)
  other vias: 20.32,36.14
N$47
  Top 0.406: R12.1 154.69,57.73 154.69,57.48 159.26,52.91 162.81,52.91 166.62,49.1 166.62,39.95 168.66,37.92 168.66,28.52 166.37,26.24 165.86,26.24 163.07,23.44 162.05,23.44 161.29,22.68 161.29,20.9 159.51,20.9 156.97,18.36
  Top 1.778: C20.2 159.91,17.05 | 159.91,17.05 JP4.15 JP4.16 | 159.91,17.05 157.78,17.05 156.97,17.86 156.97,18.36 153.82,18.36 9.OUT
N$48
  Top 1.778: 9.IN 153.56,15.57 150.88,15.57 149.92,14.61 D10.A 151.15,6.93 157.99,6.93 158.78,6.15 C23.1
N$49
  Top 1.778: C22.1 159.92,48.49 157.73,46.3 149.93,46.3 D9.C 149.89,37.38 | 149.89,37.38 151.38,35.89 153.87,35.89 | 154.43,35.89 153.87,35.89 | 153.87,35.89 8.IN | 7.IN 151.26,24.84 148.34,27.76 148.34,35.83 149.89,37.38
N$50
  Top 0.406: R11.1 147.32,57.73 148.08,58.5 152.65,58.5 159,52.15 162.56,52.15 165.86,48.84 165.86,39.95 165.61,39.45
  Top 1.27: JP4.8 165.95,27.34 167.39,28.78 167.39,37.67 165.61,39.45 164.15,39.45 C19.2
  Top 1.778: JP4.8 JP4.7 158.66,27.34 156.21,29.79 153.82,29.79 7.OUT
N$51  (via drill 0.6)
  Top 0.406: v148.08,45.8 141.99,51.89 141.99,53.67 139.95,55.7 139.95,57.73 R10.1 | v151.64,43.26 153.16,41.73 8.OUT
  Top 1.27: C21.1 160.04,38.92 161.8,37.16 164.08,37.16 165.61,35.64 165.61,30.56 164.85,29.79 162.66,29.79 JP4.6 JP4.5
  Top 1.778: C21.1 158.19,40.01 157.23,40.97 153.87,40.97 8.OUT
  Bottom 0.406: v148.08,45.8 150.11,43.76 151.13,43.76 v151.64,43.26
N$52
  Top 1.778: LED10.A 139.77,52.58 R10.2
N$53
  Top 1.778: LED11.A R11.2
N$54
  Top 1.778: LED12.K 154.88,52.58 R12.2
N$55
  Top 0.406: R18.1 220.47,57.99 220.98,58.5 225.3,58.5 228.85,54.94 228.85,53.42 237.49,44.78 237.49,30.81 230.38,23.7 230.38,19.38 228.85,17.86 JP6.16
  Top 1.778: 15.OUT 219.55,17.86 223.27,17.86 224.1,17.03 JP6.15 JP6.16 228.75,16.9 C30.2
N$56
  Top 0.406: R15.1 187.96,57.48 190.25,57.48 196.85,50.88 196.85,44.78 202.69,38.94 202.69,28.02 197.36,22.68 197.36,18.62 196.34,17.6 JP5.16
  Top 1.778: C25.2 192.93,16.98 JP5.15 | JP5.15 JP5.16 | 12.OUT 189.69,18.16 190.5,17.35 190.5,17.09 190.75,16.84 192.8,16.84 JP5.15
N$57
  Top 1.778: C28.1 189.36,8.09 D12.A 182.94,13.6 184.91,15.57 186.51,15.57 12.IN
N$58
  Top 1.778: C27.1 192.94,48.49 190.5,46.05 183.31,46.05 D11.C 182.91,36.62 | 182.91,36.62 183.64,35.89 186.46,35.89 11.IN | 10.IN 183.08,24.77 181.36,26.49 181.36,35.06 182.91,36.62
N$59  (via drill 0.6 pad 0.41)
  Top 0.406: v189.74,47.83 189.48,47.57 187.45,47.57 182.63,52.4 182.63,53.42 180.34,55.7 180.34,57.73 R14.1 | v193.29,44.27 195.33,42.24 195.33,41.99 196.85,40.46 C24.2
  Top 1.778: 10.OUT 188.67,29.85 191.01,27.51 192.81,27.51 JP5.7 JP5.8 199.9,27.25 201.17,28.52 201.17,38.18 199.16,39.67 C24.2
  Bottom 0.406: v193.29,44.27 v189.74,47.83
N$60  (via drill 0.6 pad 0.41)
  Top 0.406: v181.1,45.8 174.75,52.15 174.75,53.92 172.97,55.7 172.97,57.73 R13.1 | v184.66,43 186.18,41.48 11.OUT
  Top 1.27: JP5.5 197.62,29.8 198.63,30.81 198.63,36.14 197.87,36.91 194.06,36.91 193.29,37.67 193.29,39.44 C26.1 190.53,39.67 189.23,40.97 186.56,40.97 11.OUT
  Top 1.778: JP5.6 JP5.5
  Bottom 0.406: v181.1,45.8 183.13,43.76 183.9,43.76 v184.66,43
N$61
  Top 1.778: LED13.A R13.2
N$62
  Top 1.778: LED14.A 179.97,52.5 R14.2
N$63
  Top 1.778: LED15.K 187.65,52.76 R15.2
N$64
  Top 1.778: C33.1 222.38,8.02 D14.A 215.9,8.08 215.9,14.55 216.89,15.54 15.IN
N$65  (2 unrouted)
  Top 1.778: D13.C 222.31,46.63 C32.1
N$66  (via drill 0.6 pad 0.41)
  Top 0.406: v221.74,48.34 221.49,48.08 219.71,48.08 215.39,52.4 215.39,53.42 213.11,55.7 213.11,57.73 R17.1 | v224.03,46.05 225.3,46.05 228.09,43.26 228.09,42.24 229.87,40.46 C29.2
  Top 1.778: JP6.8 JP6.7 224.6,27.19 223.01,28.78 223.01,29.29 222.76,29.54 219.96,29.54 13.OUT | JP6.8 229.04,27.19 229.11,27.25 | 229.11,27.25 228.69,27.25 JP6.8 | 229.11,27.25 231.9,27.25 235.97,31.32 235.97,37.16 233.43,39.7 230.04,39.7 C29.2
  Bottom 0.406: v224.03,46.05 v221.74,48.34
N$67
  Top 0.406: R16.1 205.99,57.48 206.25,57.23 206.25,55.19 208.03,53.42 208.03,52.15 218.95,41.22 14.OUT
  Top 1.27: JP6.5 231.07,29.73 232.66,31.32 232.66,35.64 231.14,37.16 227.58,37.16 226.82,37.92 226.82,39.62 C31.1
  Top 1.778: JP6.5 JP6.6 | C31.1 224.38,39.85 223.27,40.97 219.81,40.97 14.OUT
N$68
  Top 1.778: LED16.A R16.2
N$69
  Top 1.778: LED17.A R17.2
N$70
  Top 1.778: LED18.K R18.2